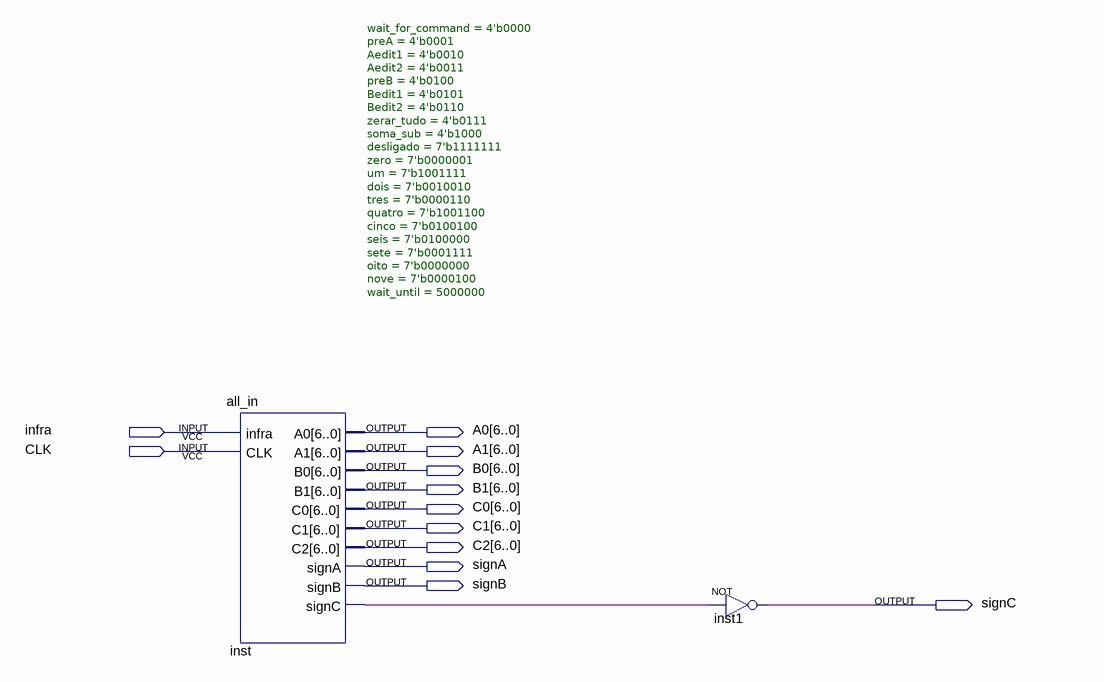
[diagram p0: schematic sheet]
// Quartus schematic ula.bdf as structural Verilog: 2 symbols, 12 pins
module ula (
  input  infra,
  input  CLK,
  output [6:0] A0,
  output [6:0] A1,
  output [6:0] B0,
  output [6:0] B1,
  output [6:0] C0,
  output [6:0] C1,
  output [6:0] C2,
  output signA,
  output signB,
  output signC
);

  wire inst_signc;

  all_in #(.wait_for_command(4'b0000), .preA(4'b0001), .Aedit1(4'b0010), .Aedit2(4'b0011), .preB(4'b0100), .Bedit1(4'b0101), .Bedit2(4'b0110), .zerar_tudo(4'b0111), .soma_sub(4'b1000), .desligado(7'b1111111), .zero(7'b0000001), .um(7'b1001111), .dois(7'b0010010), .tres(7'b0000110), .quatro(7'b1001100), .cinco(7'b0100100), .seis(7'b0100000), .sete(7'b0001111), .oito(7'b0000000), .nove(7'b0000100), .wait_until(5000000)) inst (
    .infra(infra), .CLK(CLK), .A0(A0), .A1(A1), .B0(B0), .B1(B1), .C0(C0), .C1(C1), .C2(C2), .signA(signA),
    .signB(signB), .signC(inst_signc));
  not inst1 (signC, inst_signc);
endmodule
